# EAGLE schematic RAVEN V1 (EAGLE 9.7.0)
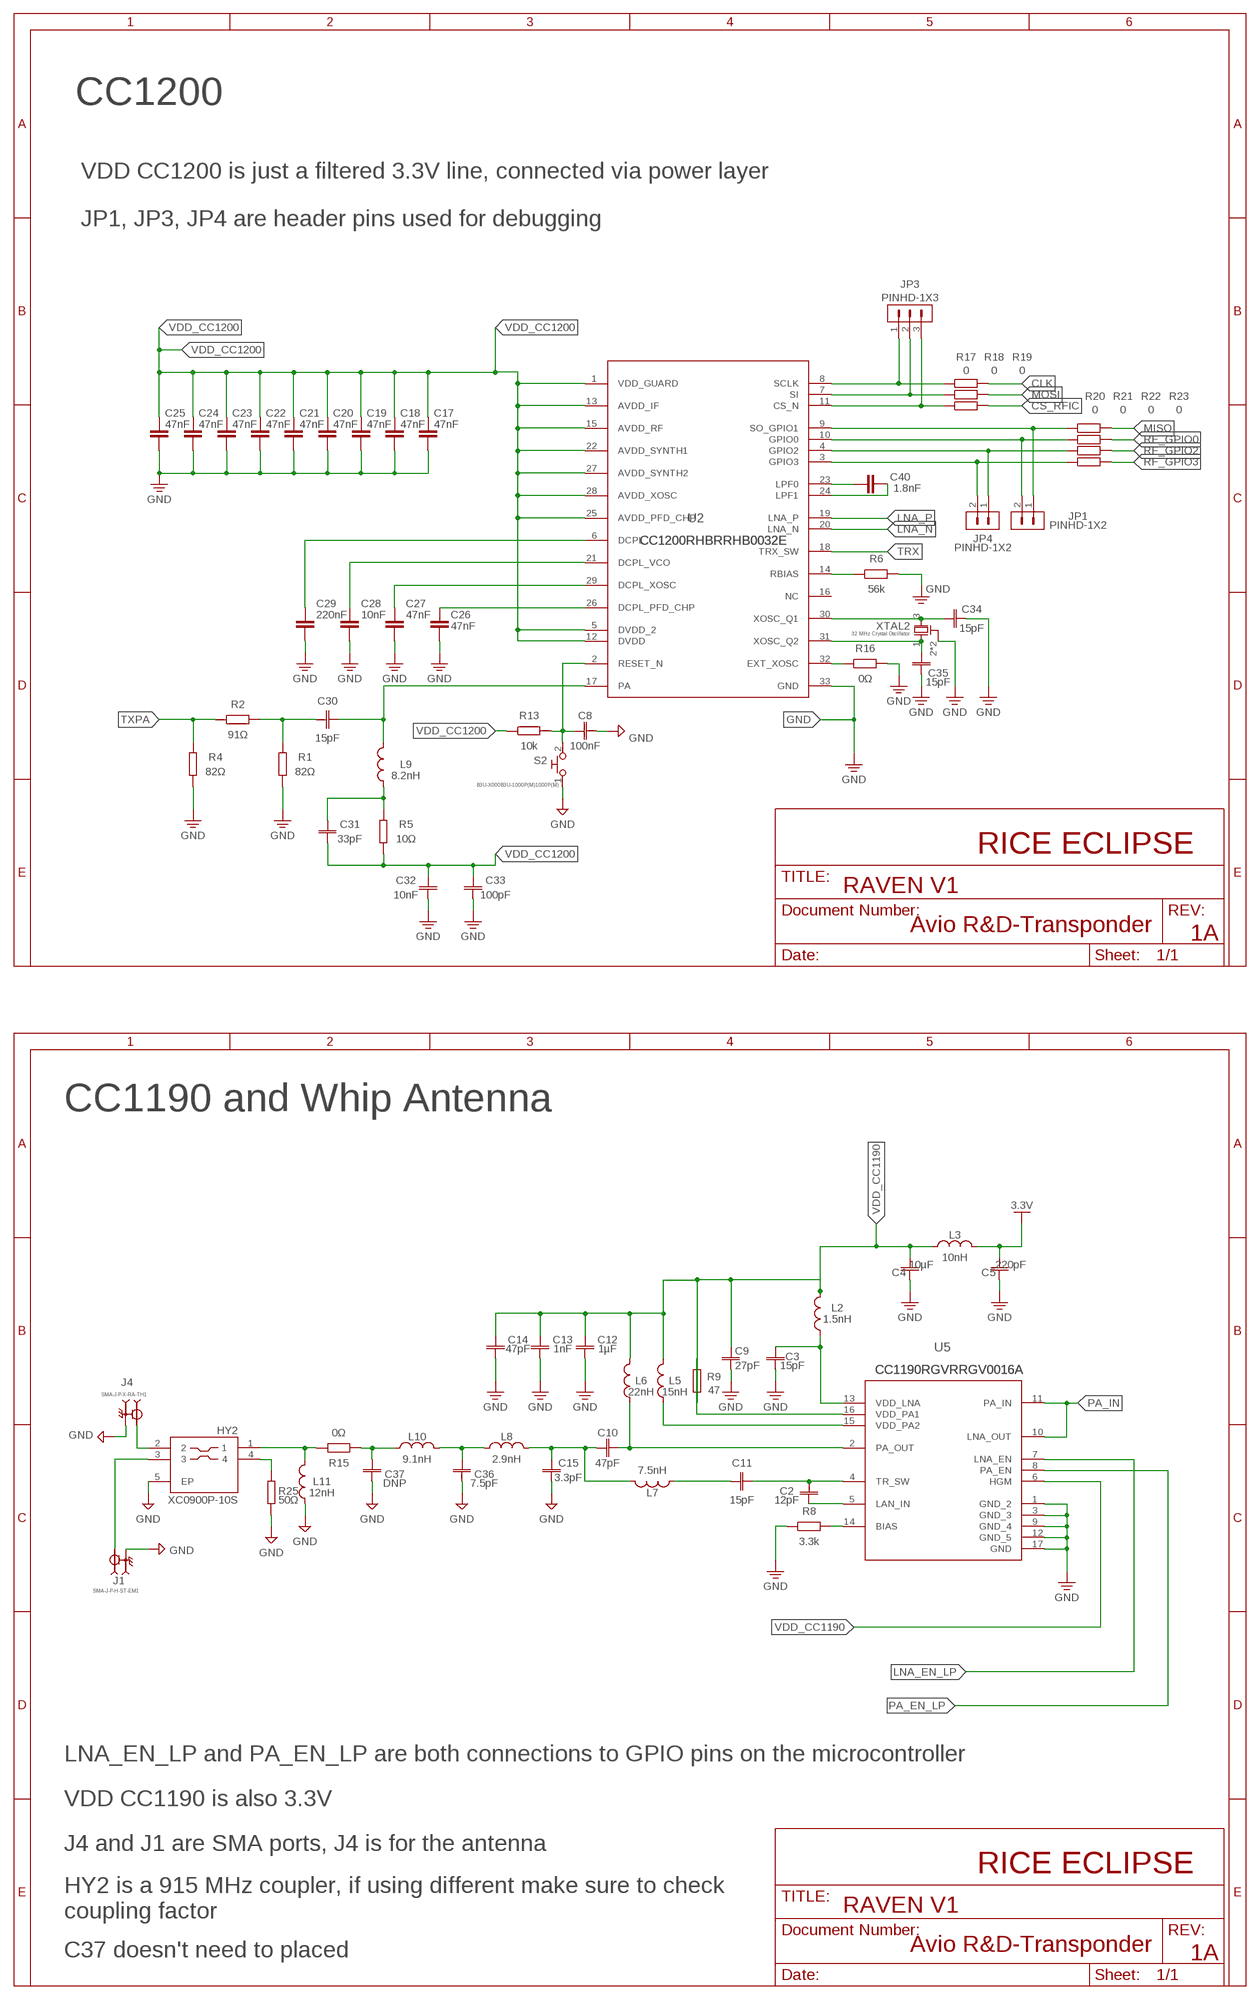
[diagram p0: schematic, sheet 1, part 1 of 2]
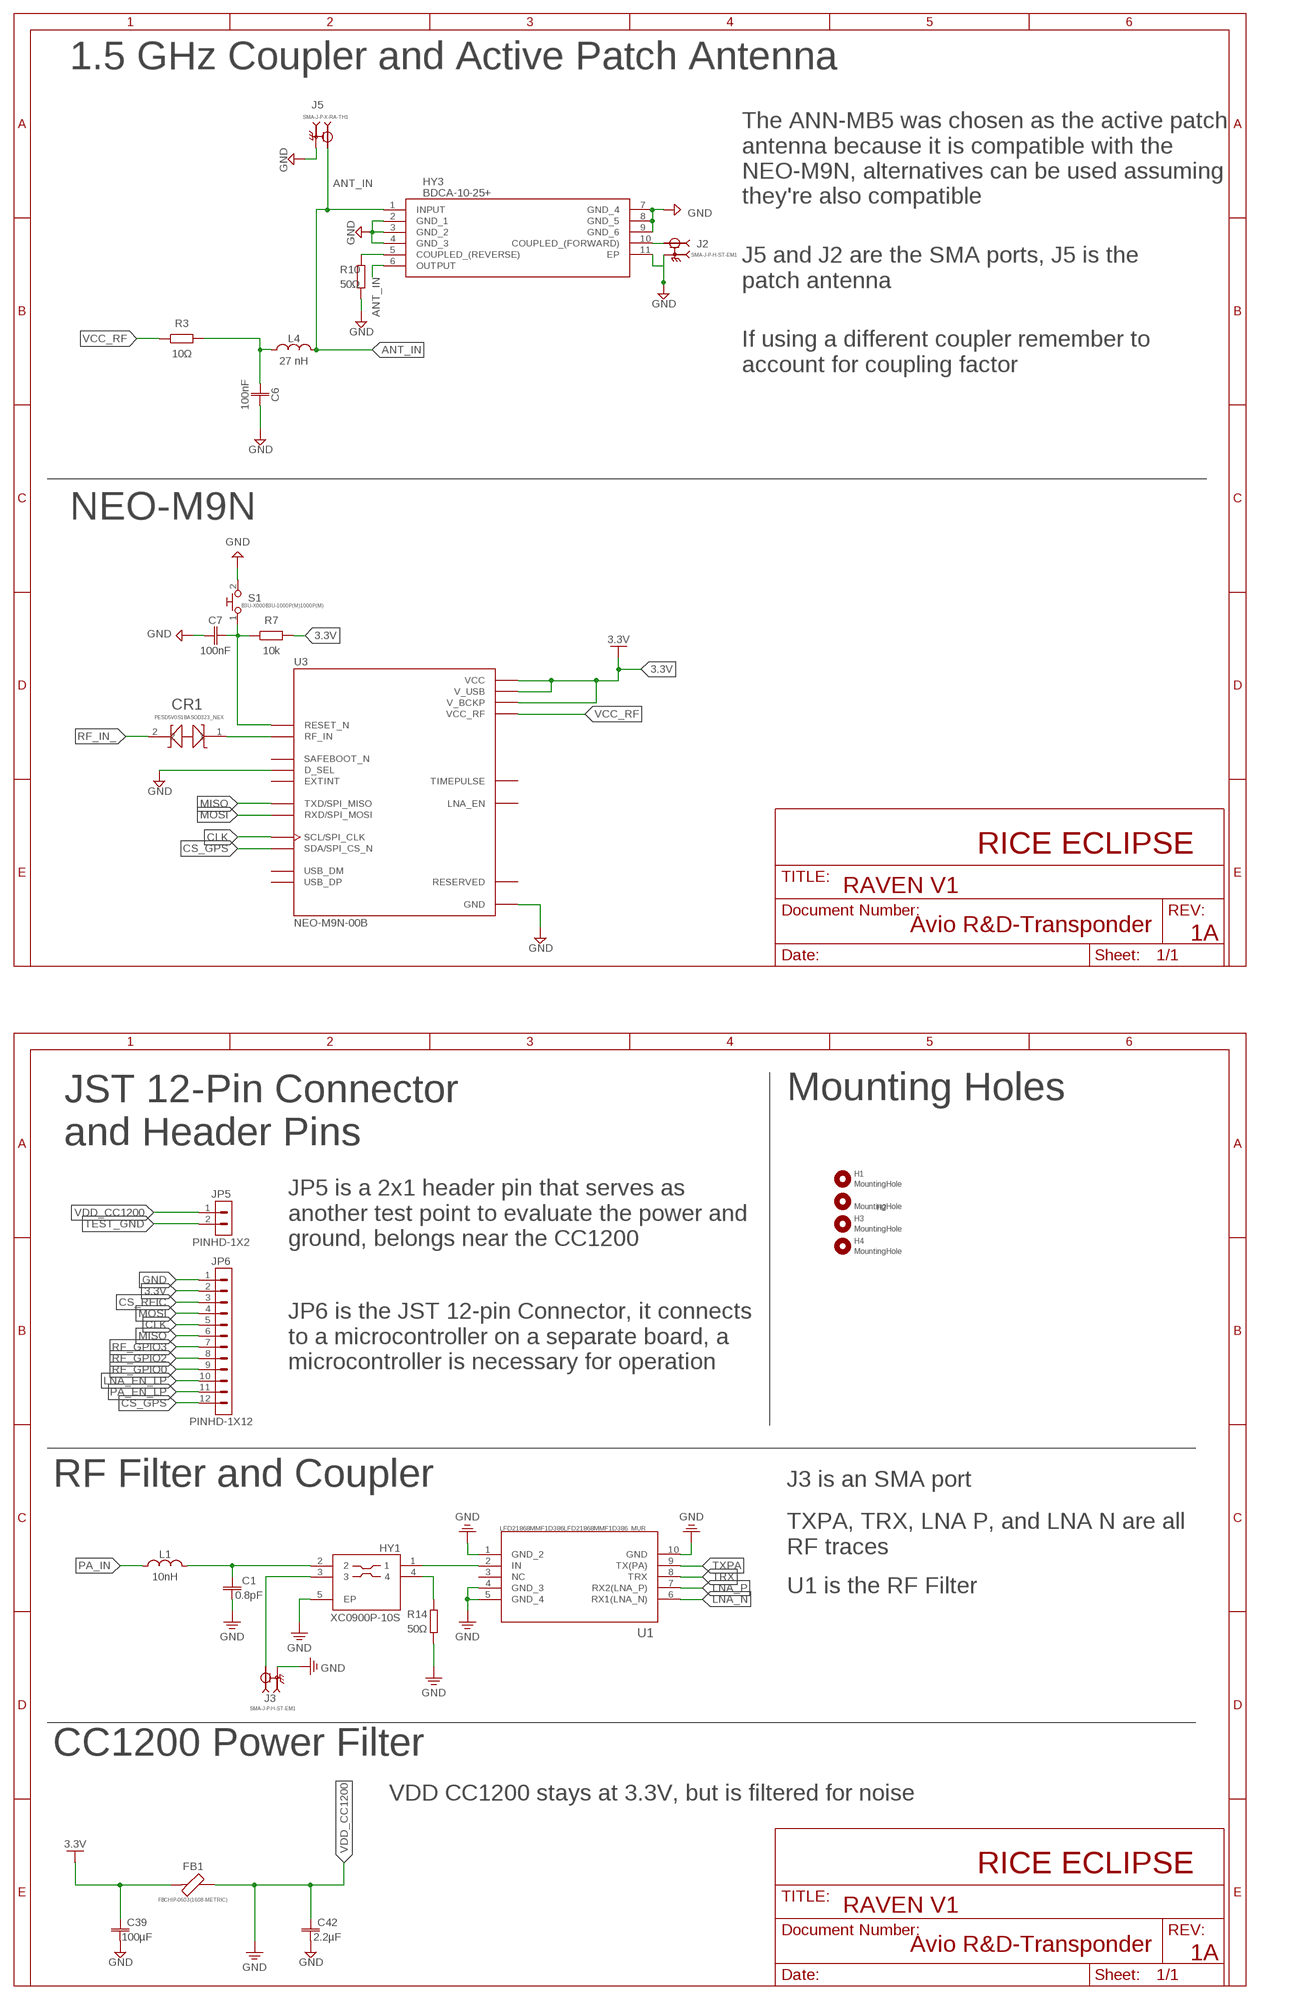
[diagram p1: schematic, sheet 1, part 2 of 2]

## Parts
C1  0.8pF  C_CHIP-0402(1005-METRIC)  [CAPC1005X60]
C2  12pF  C_CHIP-0402(1005-METRIC)  [CAPC1005X60]
C3  15pF  C_CHIP-0402(1005-METRIC)  [CAPC1005X60]
C4  10µF  C_CHIP-0402(1005-METRIC)  [CAPC1005X60]
C5  220pF  C_CHIP-0402(1005-METRIC)  [CAPC1005X60]
C6  100nF  C_CHIP-0402(1005-METRIC)  [CAPC1005X60]
C7  100nF  C_CHIP-0402(1005-METRIC)  [CAPC1005X60]
C8  100nF  C_CHIP-0402(1005-METRIC)  [CAPC1005X60]
C9  27pF  C_CHIP-0402(1005-METRIC)  [CAPC1005X60]
C10  47pF  C_CHIP-0402(1005-METRIC)  [CAPC1005X60]
C11  15pF  C_CHIP-0402(1005-METRIC)  [CAPC1005X60]
C12  1µF  C_CHIP-0402(1005-METRIC)  [CAPC1005X60]
C13  1nF  C_CHIP-0402(1005-METRIC)  [CAPC1005X60]
C14  47pF  C_CHIP-0402(1005-METRIC)  [CAPC1005X60]
C15  3.3pF  C_CHIP-0402(1005-METRIC)  [CAPC1005X60]
C17  47nF  C_CHIP-0402(1005-METRIC)  [CAPC1005X60]
C18  47nF  C_CHIP-0402(1005-METRIC)  [CAPC1005X60]
C19  47nF  C_CHIP-0402(1005-METRIC)  [CAPC1005X60]
C20  47nF  C_CHIP-0402(1005-METRIC)  [CAPC1005X60]
C21  47nF  C_CHIP-0402(1005-METRIC)  [CAPC1005X60]
C22  47nF  C_CHIP-0402(1005-METRIC)  [CAPC1005X60]
C23  47nF  C_CHIP-0402(1005-METRIC)  [CAPC1005X60]
C24  47nF  C_CHIP-0402(1005-METRIC)  [CAPC1005X60]
C25  47nF  C_CHIP-0402(1005-METRIC)  [CAPC1005X60]
C26  47nF  C_CHIP-0402(1005-METRIC)  [CAPC1005X60]
C27  47nF  C_CHIP-0402(1005-METRIC)  [CAPC1005X60]
C28  10nF  C_CHIP-0402(1005-METRIC)  [CAPC1005X60]
C29  220nF  C_CHIP-0402(1005-METRIC)  [CAPC1005X60]
C30  15pF  C_CHIP-0402(1005-METRIC)  [CAPC1005X60]
C31  33pF  C_CHIP-0402(1005-METRIC)  [CAPC1005X60]
C32  10nF  C_CHIP-0402(1005-METRIC)  [CAPC1005X60]
C33  100pF  C_CHIP-0402(1005-METRIC)  [CAPC1005X60]
C34  15pF  C_CHIP-0402(1005-METRIC)  [CAPC1005X60]
C35  15pF  C_CHIP-0402(1005-METRIC)  [CAPC1005X60]
C36  7.5pF  C_CHIP-0402(1005-METRIC)  [CAPC1005X60]
C37  DNP  C_CHIP-0402(1005-METRIC)  [CAPC1005X60]
C39  100µF  C_CHIP-0402(1005-METRIC)  [CAPC1005X60]
C40  1.8nF  C_CHIP-0402(1005-METRIC)  [CAPC1005X60]
C42  2.2µF  C_CHIP-0402(1005-METRIC)  [CAPC1005X60]
CR1  PESD5V0S1BASOD323_NEX  [SOD323_NEX]
FB1  FBCHIP-0603(1608-METRIC)  [BEADC1608X95N]
H1  MountingHole  MOUNTINGHOLEMOUNTINGHOLE_MOUNTINGHOLE_2.7MM_M2.5  [MOUNTINGHOLE_MOUNTINGHOLE_2.7MM_M2.5]
H2  MountingHole  MOUNTINGHOLEMOUNTINGHOLE_MOUNTINGHOLE_2.7MM_M2.5  [MOUNTINGHOLE_MOUNTINGHOLE_2.7MM_M2.5]
H3  MountingHole  MOUNTINGHOLEMOUNTINGHOLE_MOUNTINGHOLE_2.7MM_M2.5  [MOUNTINGHOLE_MOUNTINGHOLE_2.7MM_M2.5]
H4  MountingHole  MOUNTINGHOLEMOUNTINGHOLE_MOUNTINGHOLE_2.7MM_M2.5  [MOUNTINGHOLE_MOUNTINGHOLE_2.7MM_M2.5]
HY1  XC0900P-10S  [COUPLER_XC0900P-10S]
HY2  XC0900P-10S  [COUPLER_XC0900P-10S]
HY3  BDCA-10-25+  [BDCA1025]
J1  SMA-J-P-H-ST-EM1  [SAMTEC_SMA-J-P-H-ST-EM1]
J2  SMA-J-P-H-ST-EM1  [SAMTEC_SMA-J-P-H-ST-EM1]
J3  SMA-J-P-H-ST-EM1  [SAMTEC_SMA-J-P-H-ST-EM1]
J4  SMA-J-P-X-RA-TH1  [SAMTEC_SMA-J-P-X-RA-TH1]
J5  SMA-J-P-X-RA-TH1  [SAMTEC_SMA-J-P-X-RA-TH1]
JP1  PINHD-1X2  [1X02]
JP3  PINHD-1X3  [1X03]
JP4  PINHD-1X2  [1X02]
JP5  PINHD-1X2  [1X02]
JP6  PINHD-1X12  [1X12]
L1  10nH  L_CHIP-0402(1006-METRIC)  [INDC1006X60N]
L2  1.5nH  L_CHIP-0402(1006-METRIC)  [INDC1006X60N]
L3  10nH  L_CHIP-0402(1006-METRIC)  [INDC1006X60N]
L4  27 nH  L_CHIP-0402(1006-METRIC)  [INDC1006X60N]
L5  15nH  L_CHIP-0402(1006-METRIC)  [INDC1006X60N]
L6  22nH  L_CHIP-0402(1006-METRIC)  [INDC1006X60N]
L7  7.5nH  L_CHIP-0402(1006-METRIC)  [INDC1006X60N]
L8  2.9nH  L_CHIP-0402(1006-METRIC)  [INDC1006X60N]
L9  8.2nH  L_CHIP-0402(1006-METRIC)  [INDC1006X60N]
L10  9.1nH  L_CHIP-0402(1006-METRIC)  [INDC1006X60N]
L11  12nH  L_CHIP-0402(1006-METRIC)  [INDC1006X60N]
R1  82Ω  R_CHIP-0402(1005-METRIC)  [RESC1005X40]
R2  91Ω  R_CHIP-0402(1005-METRIC)  [RESC1005X40]
R3  10Ω  R_CHIP-0402(1005-METRIC)  [RESC1005X40]
R4  82Ω  R_CHIP-0402(1005-METRIC)  [RESC1005X40]
R5  10Ω  R_CHIP-0402(1005-METRIC)  [RESC1005X40]
R6  56k  R_CHIP-0402(1005-METRIC)  [RESC1005X40]
R7  10k  R_CHIP-0402(1005-METRIC)  [RESC1005X40]
R8  3.3k  R_CHIP-0402(1005-METRIC)  [RESC1005X40]
R9  47  R_CHIP-0402(1005-METRIC)  [RESC1005X40]
R10  50Ω  R_CHIP-0402(1005-METRIC)  [RESC1005X40]
R13  10k  R_CHIP-0402(1005-METRIC)  [RESC1005X40]
R14  50Ω  R_CHIP-0402(1005-METRIC)  [RESC1005X40]
R15  0Ω  R_CHIP-0402(1005-METRIC)  [RESC1005X40]
R16  0Ω  R_CHIP-0402(1005-METRIC)  [RESC1005X40]
R17  0  R_CHIP-0402(1005-METRIC)  [RESC1005X40]
R18  0  R_CHIP-0402(1005-METRIC)  [RESC1005X40]
R19  0  R_CHIP-0402(1005-METRIC)  [RESC1005X40]
R20  0  R_CHIP-0402(1005-METRIC)  [RESC1005X40]
R21  0  R_CHIP-0402(1005-METRIC)  [RESC1005X40]
R22  0  R_CHIP-0402(1005-METRIC)  [RESC1005X40]
R23  0  R_CHIP-0402(1005-METRIC)  [RESC1005X40]
R25  50Ω  R_CHIP-0402(1005-METRIC)  [RESC1005X40]
S1  B3U-X000B3U-1000P(M)1000P(M)  [B3U-1000P(M)]
S2  B3U-X000B3U-1000P(M)1000P(M)  [B3U-1000P(M)]
U1  LFD21868MMF1D386LFD21868MMF1D386_MUR  [LFD21868MMF1D386_MUR]
U2  CC1200RHBRRHB0032E  [RHB0032E]
U3  NEO-M9N-00B  [XCVR_NEO-M9N-00B]
U5  CC1190RGVRRGV0016A  [RGV0016A]
XTAL2  32 MHz Crystal Oscillator  ABM3BFREQUENCY_12.288MHZ  [OSCSC500X320X110-4N]

## Nets
3.3V: C5.2 C39.2 FB1.1 JP6.2 L3.2 R7.2 U3.7(V_USB) U3.22(V_BCKP) U3.23(VCC)
ANT_IN: HY3.1(INPUT) HY3.6(OUTPUT) J5.1 L4.2
CLK: JP3.1 JP6.5 R17.1 R17.2 U2.8(SCLK) U3.19(SCL/SPI_CLK)
CS_GPS: JP6.12 U3.18(SDA/SPI_CS_N)
CS_RFIC: JP3.3 JP6.3 R19.1 R19.2 U2.11(CS_N)
GND: C1.1 C3.1 C4.1 C5.1 C6.2 C7.1 C8.2 C9.1 C12.1 C13.1 C14.1 C15.1 C17.2 C18.2 C19.2 C20.2 C21.2 C22.2 C23.2 C24.2 C25.2 C26.2 C27.2 C28.2 C29.2 C32.1 C33.1 C34.2 C35.1 C36.1 C37.1 C39.1 C42.1 HY1.5(EP) HY2.5(EP) HY3.2(GND_1) HY3.3(GND_2) HY3.4(GND_3) HY3.7(GND_4) HY3.8(GND_5) HY3.9(GND_6) HY3.11(EP) J1.2_1 J1.2_2 J1.3_1 J1.3_2 J2.2_1 J2.2_2 J2.3_1 J2.3_2 J3.2_1 J3.2_2 J3.3_1 J3.3_2 J4.2 J4.3 J4.4 J4.5 J5.2 J5.3 J5.4 J5.5 JP6.1 L11.1 R1.1 R4.1 R6.2 R8.1 R10.1 R14.1 R16.2 R25.1 S1.2 S2.1 U1.1(GND_2) U1.4(GND_3) U1.5(GND_4) U1.10(GND) U2.33(GND) U3.2(D_SEL) U3.10(GND) U3.12(GND) U3.13(GND) U3.24(GND) U5.1(GND_2) U5.3(GND_3) U5.9(GND_4) U5.12(GND_5) U5.17(GND) XTAL2.2(GND) XTAL2.4(GND)
LNA_EN_LP: JP6.10 U5.7(LNA_EN)
LNA_N: U1.6(RX1(LNA_N)) U2.20(LNA_N)
LNA_P: U1.7(RX2(LNA_P)) U2.19(LNA_P)
MISO: JP6.6 R20.2 U3.20(TXD/SPI_MISO)
MISO_2: JP1.1 R20.1 U2.9(SO_GPIO1)
MOSI: JP3.2 JP6.4 R18.1 R18.2 U2.7(SI) U3.21(RXD/SPI_MOSI)
N$1: HY1.1 U1.2(IN)
N$2: C1.2 HY1.2 L1.2
N$3: R8.2 U5.14(BIAS)
N$4: L5.1 U5.15(VDD_PA2)
N$5: C2.2 C11.1 U5.4(TR_SW)
N$6: C2.1 U5.5(LAN_IN)
N$7: C3.2 L2.1 U5.13(VDD_LNA)
N$8: CR1.1 U3.11(RF_IN)
N$9: R9.1 U5.16(VDD_PA1)
N$10: C7.2 R7.1 S1.1 U3.8(RESET_N)
N$11: C10.2 L6.1 U5.2(PA_OUT)
N$12: C11.2 L7.1
N$13: C6.1 L4.1 R3.2
N$14: HY1.4 R14.2
N$15: HY1.3 J3.1
N$16: HY3.10(COUPLED_(FORWARD)) J2.1
N$17: HY3.5(COUPLED_(REVERSE)) R10.2
N$19: C26.1 U2.26(DCPL_PFD_CHP)
N$21: C28.1 U2.21(DCPL_VCO)
N$22: C29.1 U2.6(DCPL)
N$23: R16.1 U2.32(EXT_XOSC)
N$25: R23.2
N$26: C27.1 U2.29(DCPL_XOSC)
N$31: C30.2 L9.2 U2.17(PA)
N$32: C31.2 L9.1 R5.2
N$34: C30.1 R1.2 R2.2
N$35: C36.2 L8.1 L10.2
N$36: C34.1 U2.30(XOSC_Q1) XTAL2.3
N$37: C35.2 U2.31(XOSC_Q2) XTAL2.1
N$38: R6.1 U2.14(RBIAS)
N$41: C40.1 U2.23(LPF0)
N$42: C40.2 U2.24(LPF1)
N$58: C37.2 L10.1 R15.1
N$59: HY2.2 J4.1
N$61: HY2.3 J1.1
N$62: HY2.4 R25.2
N$63: HY2.1 L11.2 R15.2
N$64: C10.1 C15.2 L7.2 L8.2
PA_EN_LP: JP6.11 U5.8(PA_EN)
PA_IN: L1.1 U5.10(LNA_OUT) U5.11(PA_IN)
RF_GPIO0: JP6.9 R21.2
RF_GPIO2: JP6.8 R22.2
RF_GPIO2_IN: JP4.1 R22.1 U2.4(GPIO2)
RF_GPIO3: JP4.2 JP6.7 R23.1 U2.3(GPIO3)
RF_GPIO_IN_0: JP1.2 R21.1 U2.10(GPIO0)
RF_IN_: CR1.2
RF_RESET_N: C8.1 R13.2 S2.2 U2.2(RESET_N)
TEST_GND: JP5.2
TRX: U1.8(TRX) U2.18(TRX_SW)
TXPA: R2.1 R4.2 U1.9(TX(PA))
VCC_RF: R3.1 U3.9(VCC_RF)
VDD_CC1190: C4.2 C9.2 C12.2 C13.2 C14.2 L2.2 L3.1 L5.2 L6.2 R9.2 U5.6(HGM)
VDD_CC1200: C17.1 C18.1 C19.1 C20.1 C21.1 C22.1 C23.1 C24.1 C25.1 C31.1 C32.2 C33.2 C42.2 FB1.2 JP5.1 R5.1 R13.1 U2.1(VDD_GUARD) U2.5(DVDD_2) U2.12(DVDD) U2.13(AVDD_IF) U2.15(AVDD_RF) U2.22(AVDD_SYNTH1) U2.25(AVDD_PFD_CHP) U2.27(AVDD_SYNTH2) U2.28(AVDD_XOSC) ; supply symbol labelled GND
Unconnected: U1.3(NC) U2.16(NC) U3.1(SAFEBOOT_N) U3.3(TIMEPULSE) U3.4(EXTINT) U3.5(USB_DM) U3.6(USB_DP) U3.14(LNA_EN) U3.15(RESERVED) U3.16(RESERVED) U3.17(RESERVED)

## Notes on the sheet
- 1.5 GHz Coupler and Active Patch Antenna
- CC1200
- VDD CC1200 is just a filtered 3.3V line, connected via power layer
- The ANN-MB5 was chosen as the active patch
  antenna because it is compatible with the 
  NEO-M9N, alternatives can be used assuming
  they're also compatible
- JP1, JP3, JP4 are header pins used for debugging
- J5 and J2 are the SMA ports, J5 is the 
  patch antenna
- If using a different coupler remember to
  account for coupling factor
- NEO-M9N
- RICE ECLIPSE | RICE ECLIPSE
- Avio R&D-Transponder | Avio R&D-Transponder
- 1A | 1A
- CC1190 and Whip Antenna | Mounting Holes
- JST 12-Pin Connector 
  and Header Pins
- JP5 is a 2x1 header pin that serves as 
  another test point to evaluate the power and 
  ground, belongs near the CC1200
- JP6 is the JST 12-pin Connector, it connects 
  to a microcontroller on a separate board, a 
  microcontroller is necessary for operation
- RF Filter and Coupler | J3 is an SMA port
- TXPA, TRX, LNA P, and LNA N are all 
  RF traces
- U1 is the RF Filter
- LNA_EN_LP and PA_EN_LP are both connections to GPIO pins on the microcontroller | CC1200 Power Filter
- VDD CC1190 is also 3.3V | VDD CC1200 stays at 3.3V, but is filtered for noise
- J4 and J1 are SMA ports, J4 is for the antenna
- RICE ECLIPSE | RICE ECLIPSE
- HY2 is a 915 MHz coupler, if using different make sure to check 
  coupling factor
- C37 doesn't need to placed | Avio R&D-Transponder | Avio R&D-Transponder
- 1A | 1A

## Library data of the parts
C1-C15 C30-C37 C39 C42 = Capacitor:C: Capacitor - Generic; CATEGORY: Capacitor; PACKAGE_SIZE: 0402; PACKAGE_TYPE: Surface Mount; SUBCATEGORY: Ceramic Capacitors; TYPE: MLCC
C17-C29 C40 = Tutorial - Fusion 360:C: Capacitor - Generic; CATEGORY: Capacitor
CR1 = 2025-11-21_00-10-00_Library:PESD5V0S1BA; COPYRIGHT: Copyright (C) 2025 Ultra Librarian. All rights reserved.; MANUFACTURER_NAME: Nexperia; MANUFACTURER_PART_NUMBER: PESD5V0S1BA
FB1 = Filter:FB: Ferrite Bead - Generic; CATEGORY: Ferrite Bead; DESCRIPTION: Generic Ferrite Bead 0603 (1608 Metric); PACKAGE_SIZE: 0603; PACKAGE_TYPE: Surface Mount
H1-H4 = Mechanical:MOUNTINGHOLE: Mounting Hole without connection; DATASHEET: ~; FOOTPRINT: MountingHole:MountingHole_2.7mm_M2.5
HY1 HY2 = XC0900P-10S:XC0900P-10S; MANUFACTURER: Anaren; MAXIMUM_PACKAGE_HEIGHT: 2.14mm; PARTREV: D; STANDARD: Manufacturer Recommendations
HY3 = BDCA-10-25+:BDCA-10-25+: RF Directional Coupler Cellular, PCN, PCS 800MHz ~ 2.5GHz 10.1 +/- 2dB 50W 10-SMD, Flat Leads Source: Datasheet <https://www.digikey.ph/en/products/detail/mini-circuits/BDCA-10-25/20526682>; DESCRIPTION: RF Directional Coupler Cellular, PCN, PCS 800MHz ~ 2.5GHz 10.1 +/- 2dB 50W 10-SMD, Flat Leads; HEIGHT: 1.78mm; MANUFACTURER_NAME: Mini-Circuits; MANUFACTURER_PART_NUMBER: BDCA-10-25+; MOUSER_PART_NUMBER: 139-BDCA-10-25+; MOUSER_PRICE-STOCK: https://www.mouser.co.uk/ProductDetail/Mini-Circuits/BDCA-10-25%2b?qs=Znm5pLBrcAIT4tjFMUCF%2Fg%3D%3D
J1-J3 = SMA-J-P-H-ST-EM1:SMA-J-P-H-ST-EM1; MANUFACTURER: Samtec; MAXIMUM_PACKAGE_HEIGHT: 3.675mm; PARTREV: G; STANDARD: Manufacturer Recommendations
J4 J5 = SMA-J-P-X-RA-TH1:SMA-J-P-X-RA-TH1; MANUFACTURER: Samtec; MAXIMUM_PACKAGE_HEIGHT: 9.86mm; PARTREV: K; STANDARD: Manufacturer Recommendations
JP1 JP4 JP5 = Connector:PINHD-1X2: Pin Header; CATEGORY: Connectors; DESCRIPTION: Header-Straight-2 Position; PACKAGE_TYPE: Through Hole; PITCH: 0.100" (2.54mm); SUBCATEGORY: Headers; TYPE: Male Pins
JP3 = Connector:PINHD-1X3: Pin Header; CATEGORY: Connectors; DESCRIPTION: Header-Straight-3 Position; PACKAGE_TYPE: Through Hole; PITCH: 0.100" (2.54mm); SUBCATEGORY: Headers; TYPE: Male Pins
JP6 = Connector:PINHD-1X12: Pin Header; CATEGORY: Connectors; DESCRIPTION: Header-Straight-12 Position; PACKAGE_TYPE: Through Hole; PITCH: 0.100" (2.54mm); SUBCATEGORY: Headers; TYPE: Male Pins
L1-L11 = Inductor:L: Inductor Fixed - Generic; CATEGORY: Inductors; DESCRIPTION: Chip 1.00 X 0.60 X 0.60 mm body 0402(1006-METRIC); PACKAGE_SIZE: 0402; PACKAGE_TYPE: Surface Mount
R1-R10 R13-R23 R25 = Resistor:R: Resistor Fixed - Generic; CATEGORY: Resistors; DESCRIPTION: Chip Resistor 1.05 X 0.54 X 0.40 mm body 0402(1005-METRIC) Package; PACKAGE_SIZE: 0402; PACKAGE_TYPE: Surface Mount
S1 S2 = Switch:B3U-X000: Ultra-small Tactile Switch Contact form : SPST-NO Reference: Datasheet <https://omronfs.omron.com/en_US/ecb/products/pdf/en-b3u.pdf>; CATEGORY: Switches; DATASHEET: https://omronfs.omron.com/en_US/ecb/products/pdf/en-b3u.pdf; DESCRIPTION: Tactile Switch SPST-NO Top Actuated Surface Mount; MANUFACTURER: Omron Electronics Inc-EMC Div; MPN: B3U-1000PM; OPERATING_TEMPERATURE: -25°C ~ 70°C; PACKAGE_SIZE: NA; PACKAGE_TYPE: SMD; PART_STATUS: ACTIVE; ROHS: COMPLIANT; SERIES: B3U; SUBCATEGORY: Tactile Switches; TYPE: SPST-NO
U1 = 2025-11-22_22-16-28_Library:LFD21868MMF1D386; COPYRIGHT: Copyright (C) 2025 Ultra Librarian. All rights reserved.; MANUFACTURER_NAME: Murata; MANUFACTURER_PART_NUMBER: LFD21868MMF1D386
U2 = 2026-02-05_04-38-19_Library:CC1200RHBR; COPYRIGHT: Copyright (C) 2026 Ultra Librarian. All rights reserved.; DATASHEET: https://www.ti.com/lit/gpn/cc1200; DESCRIPTION: Low power and high performance wireless transceiver 32-VQFN -40 to 85; MANUFACTURER_NAME: Texas Instruments; MANUFACTURER_PART_NUMBER: CC1200RHBR; REFDES: RefDes; TYPE: TYPE
U3 = NEO-M9N-00B:NEO-M9N-00B; MANUFACTURER: U blox; MAXIMUM_PACKAGE_HEIGHT: 2.6mm; PARTREV: R05; STANDARD: Manufacturer Recommendations
U5 = 2025-11-22_22-42-33_Library:CC1190RGVR; COPYRIGHT: Copyright (C) 2025 Ultra Librarian. All rights reserved.; DATASHEET: https://www.ti.com/lit/gpn/cc1190; DESCRIPTION: 850 - 950MHz RF front end 16-VQFN -40 to 85; MANUFACTURER_NAME: Texas Instruments; MANUFACTURER_PART_NUMBER: CC1190RGVR; REFDES: RefDes; TYPE: TYPE
XTAL2 = Frequency-Source:ABM3B: CRYSTAL 8.0000MHZ 18PF SMD 8MHz ±20ppm Crystal 18pF 200 Ohms 4-SMD No Lead Reference: Datasheet <https://abracon.com/Resonators/abm3b.pdf>; CATEGORY: Crystals; DATASHEET: https://abracon.com/Resonators/abm3b.pdf; DESCRIPTION: 12.288 MHz ±20 ppm Crystal 18 pF 70 Ohms 4-SMD No Lead; FREQUENCY: 12.288 MHz; FREQUENCY_STABILITY: ±50 ppm; LOAD_CAPACITANCE: 18 pF; MANUFACTURER: Abracon LLC; MPN: ABM3B-12.288MHZ-B2-T; OPERATING_TEMPERATURE: -20°C ~ 70°C; PACKAGE_SIZE: 4-SMD No Lead; PACKAGE_TYPE: Surface Mount; PART_STATUS: Active; ROHS: Compliant; SERIES: ABM3B; SUBCATEGORY: Oscillators; TOLERANCE: ±20 ppm; TYPE: Resonators

## Net classes
0 Default: width 0.15 mm, drill 0.35 mm, clearance 0.15 mm
3 Antenna: width 1 mm, clearance 0.3 mm